# Altium schematic sheet Spartan3_TestBoard_3.SchDoc
size A4; SheetNumber: 3; SheetTotal: 3
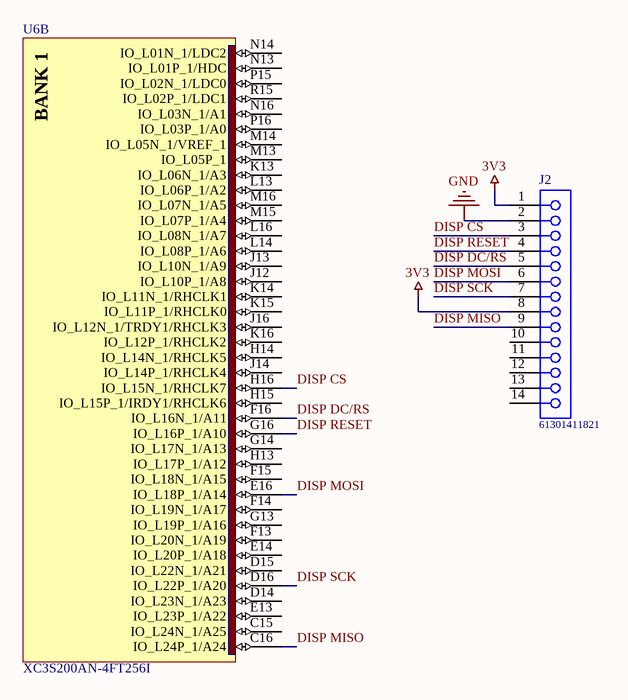
[diagram p0: Spartan3_TestBoard_3.SchDoc]

## Parts
J2  61301411821  [61301411821]
U6  XC3S200AN-4FT256I  [XC3S200AN-4FT256I]  (part B of 8)

## Nets
3V3: J2.1 J2.8
GND: J2.2
DISP CS: J2.3 U6.H16(IO_L15N_1/RHCLK7)
DISP DC/RS: J2.5 U6.F16(IO_L16N_1/A11)
DISP MISO: J2.9 U6.C16(IO_L24P_1/A24)
DISP MOSI: J2.6 U6.E16(IO_L18P_1/A14)
DISP RESET: J2.4 U6.G16(IO_L16P_1/A10)
DISP SCK: J2.7 U6.D16(IO_L22P_1/A20)

Not connected (* = marked no-connect by the designer): J2 10 11 12 13 14; U6 C15(IO_L24N_1/A25) D14(IO_L23N_1/A23) D15(IO_L22N_1/A21) E13(IO_L23P_1/A22) E14(IO_L20P_1/A18) F13(IO_L20N_1/A19) F14(IO_L19N_1/A17) F15(IO_L18N_1/A15) G13(IO_L19P_1/A16) G14(IO_L17N_1/A13) H13(IO_L17P_1/A12) H14(IO_L14N_1/RHCLK5) H15(IO_L15P_1/IRDY1/RHCLK6) J12(IO_L10P_1/A8) J13(IO_L10N_1/A9) J14(IO_L14P_1/RHCLK4) J16(IO_L12N_1/TRDY1/RHCLK3) K13(IO_L06N_1/A3) K14(IO_L11N_1/RHCLK1) K15(IO_L11P_1/RHCLK0) K16(IO_L12P_1/RHCLK2) L13(IO_L06P_1/A2) L14(IO_L08P_1/A6) L16(IO_L08N_1/A7) M13(IO_L05P_1) M14(IO_L05N_1/VREF_1) M15(IO_L07P_1/A4) M16(IO_L07N_1/A5) N13(IO_L01P_1/HDC) N14(IO_L01N_1/LDC2) N16(IO_L03N_1/A1) P15(IO_L02N_1/LDC0) P16(IO_L03P_1/A0) R15(IO_L02P_1/LDC1)

## Notes on the sheet
- (in symbol XC3S200AN-4FT256I, part B) BANK 1

## Library data of the parts
J2 = 61301411821: WR-PHD Socket Header, THT, pitch 2.54mm, Single Row, Vertical, 14p; Manufacturer: Wurth Elektronik; Pin Number: 14; Rated Current: 3A; Working Voltage: 250VAC; Withstanding Voltage: 500VAC; Contact Resistance: 20mOhm; ComponentLink1Description: Manufacturer; ComponentLink1URL: http://www.we-online.de; ComponentLink2Description: Datasheet; ComponentLink2URL: https://www.we-online.com/catalog/datasheet/61301411821.pdf; Manufacturer Part Number: 61301411821; Published Date: May 2020; Pitch: 2.54mm; Operating Temperature: -40 to +125degC; Mounting Technology: THT; Packaging: Tray; Gender: Socket Header; Row Number: Single; Orientation: Vertical
U6 = XC3S200AN-4FT256I: Spartan-3AN Non-Volatile FPGA, 195 User I/Os, 256-Pin FTBGA, Standard Performance, Industrial Grade; Code_JEDEC: MS-034-AAF-1*; PackageVersion: ver1.3, Oct-2007; PackageReference: FT256; PackageDescription: 256-Ball Fine Pitch Thin Ball Grid Array 1.00 mm Pitch (FT256); DatasheetVersion: ver 3.2, Nov-2009; PartNumber: XC3S200AN-4FT256I